# EasyEDA Pro project LC86G-PA Breakout Board V2_1 (easyEDA Pro project file).eprj

# Schematic Schematic1_1
Board Name: Board1_1; Create Date: 2025-05-26; Page Name: P1; Project Name: LC86G-PA Breakout Board V2; Schematic Name: Schematic1_1; Update Date: 2025-05-25; Company: EasyEDA.com; Page Size: A4; Version: V1.0
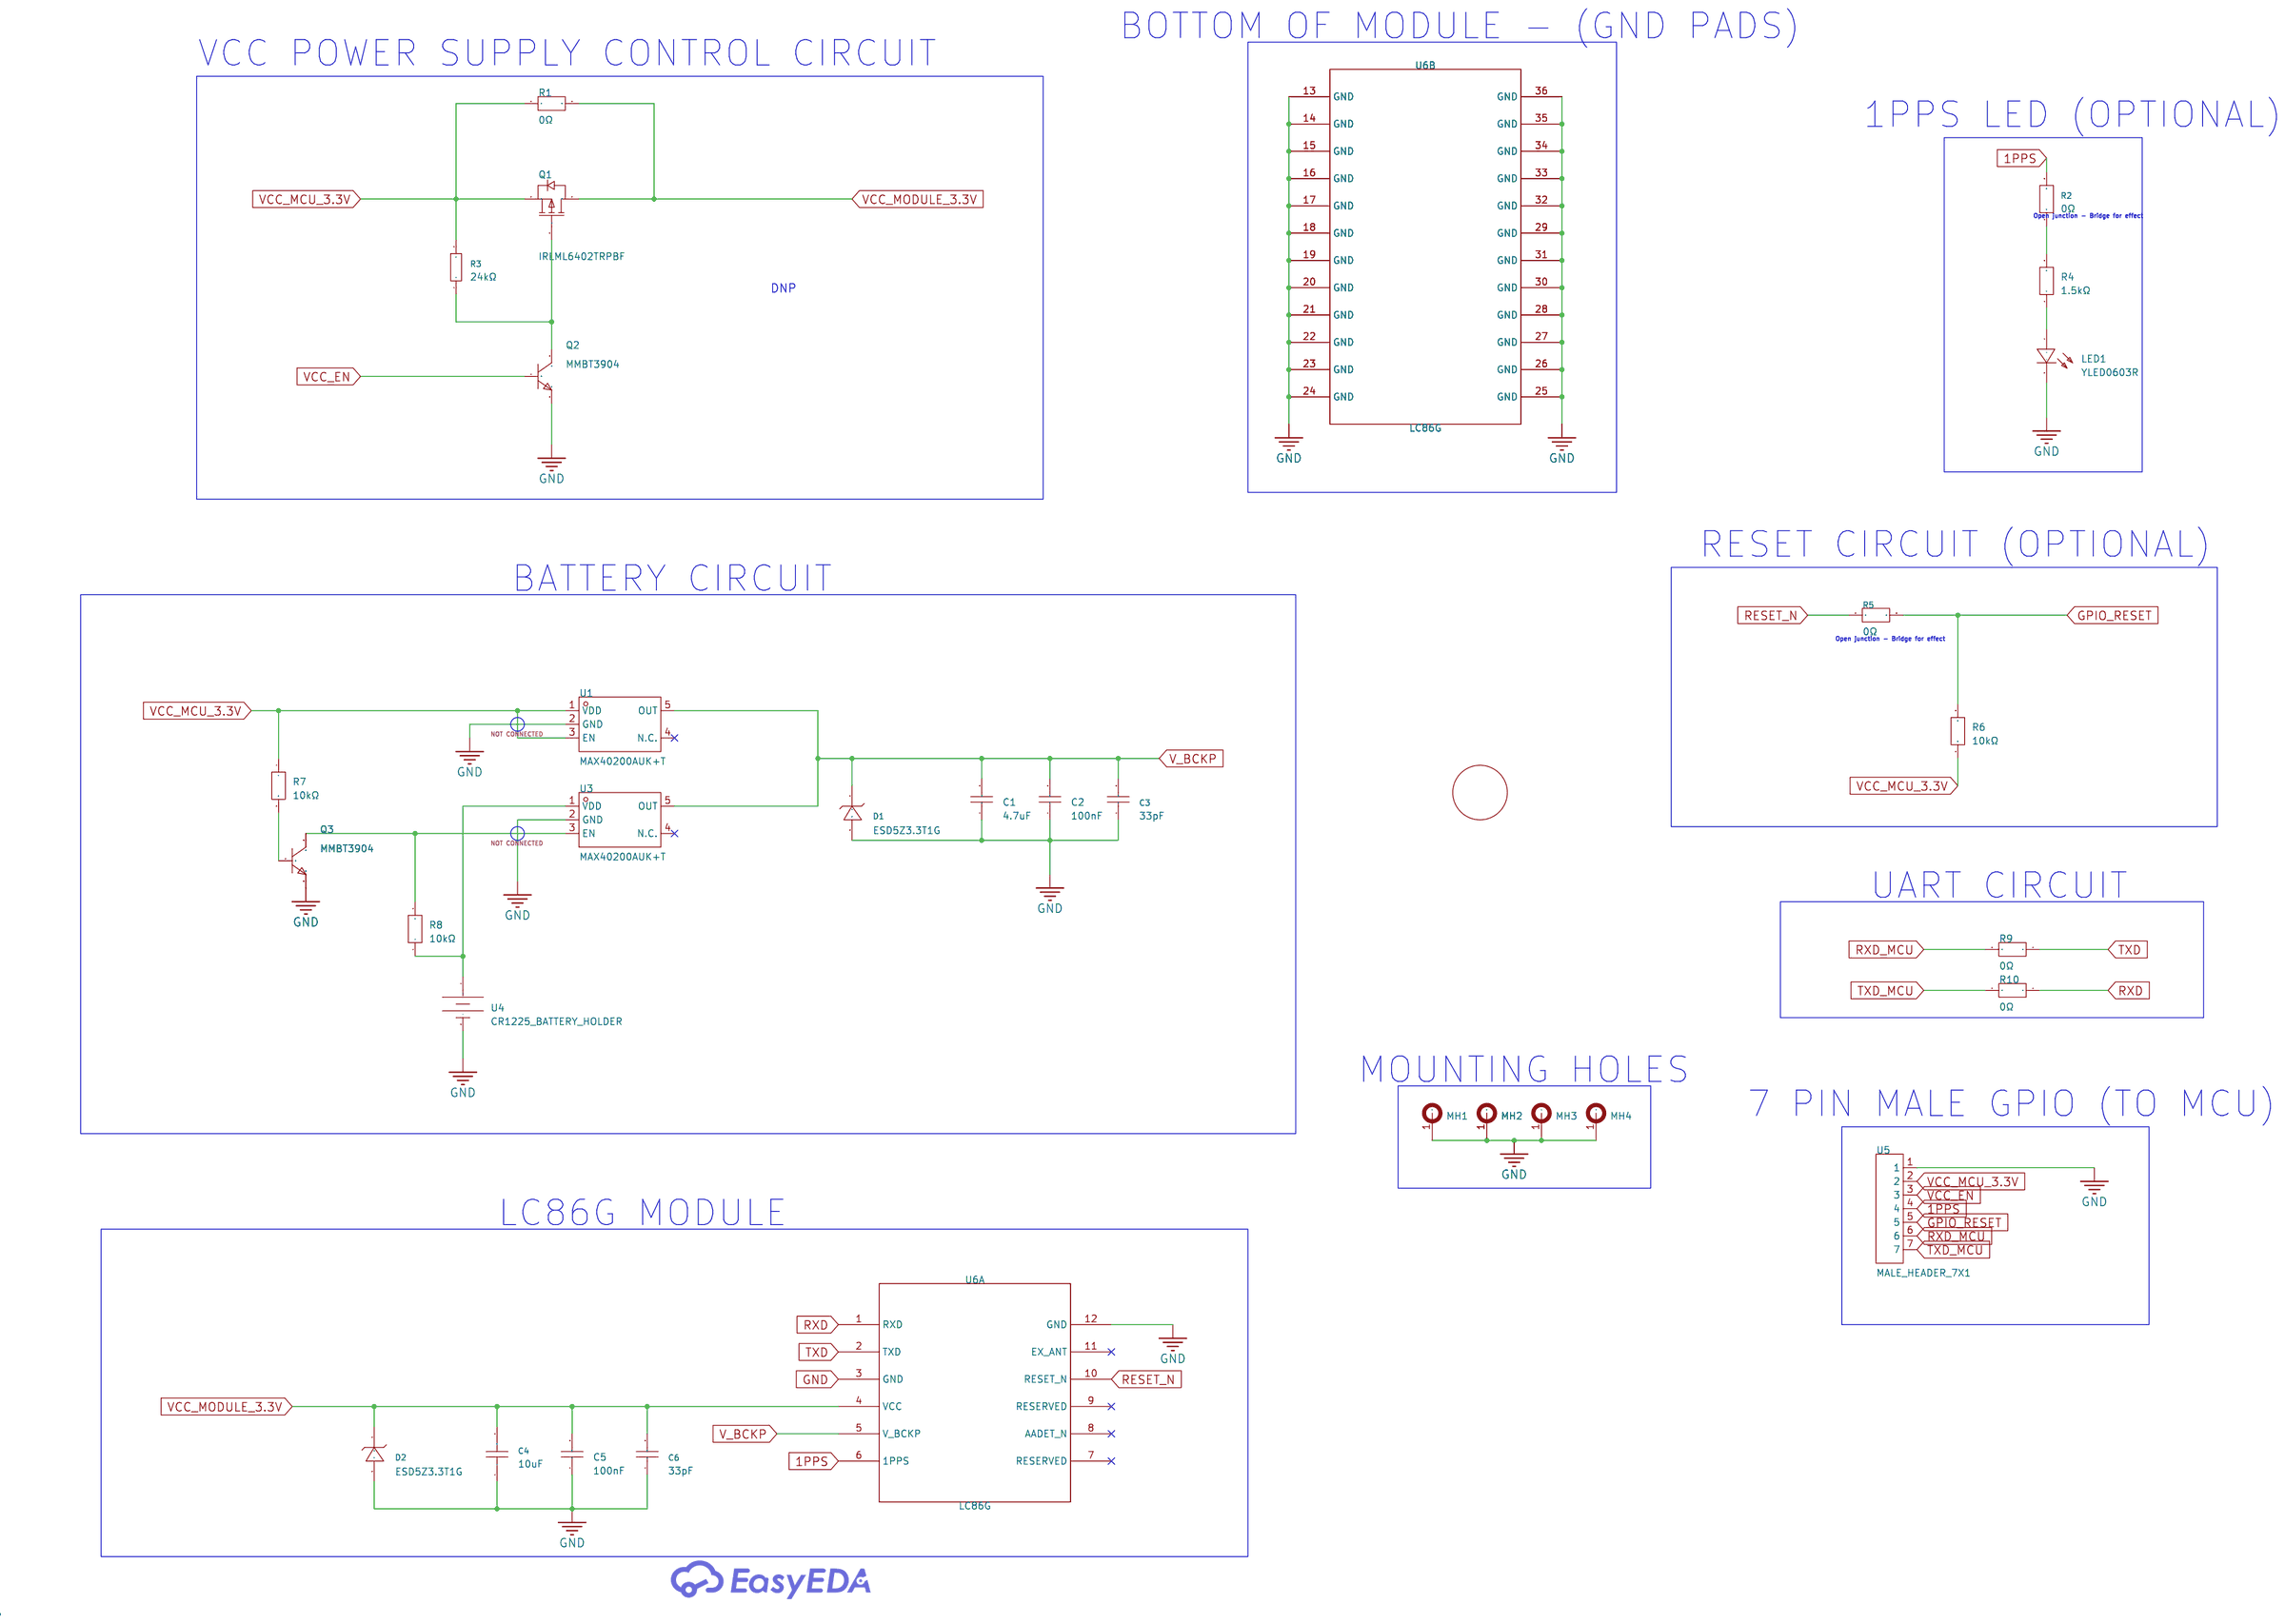
[diagram p0: schematic sheet]

## Parts
C1  4.7uF  [C0603]
C2  100nF  [C0603]
C3  33pF  [C0603]
C4  10uF  [C0603]
C5  100nF  [C0603]
C6  33pF  [C0603]
D1  ESD5Z3.3T1G  [SOD-523F_L1.2-W0.8-LS1.7-RD]
D2  ESD5Z3.3T1G  [SOD-523F_L1.2-W0.8-LS1.7-RD]
LED1  YLED0603R  [LED0603-FD]
MH1  -  [MH_7.5x2.7MM]  (no BOM)
MH2  -  [MH_7.5x2.7MM]  (no BOM)
MH3  -  [MH_7.5x2.7MM]  (no BOM)
MH4  -  [MH_7.5x2.7MM]  (no BOM)
Q1  IRLML6402TRPBF  [SOT-23-3_L2.9-W1.6-P1.90-LS2.8-BR]
Q2  MMBT3904  [SOT-23-3_L2.9-W1.4-P1.90-LS2.6-BR]
Q3  MMBT3904  [SOT-23-3_L2.9-W1.4-P1.90-LS2.6-BR]
R1  0Ω  [R0603]
R2  0Ω  [R0201]
R3  24kΩ  [R0603]
R4  1.5kΩ  [R0603]
R5  0Ω  [R0201]
R6  10kΩ  [R0603]
R7  10kΩ  [R0603]
R8  10kΩ  [R0603]
R9  0Ω  [R0603]
R10  0Ω  [R0603]
U1  MAX40200AUK+T  [TSOT-23-5_L2.9-W1.6-P0.95-LS2.8-BL]
U2  -  [KEEPOUT HOLEf]  (no BOM)
U3  MAX40200AUK+T  [TSOT-23-5_L2.9-W1.6-P0.95-LS2.8-BL]
U4  CR1225_BATTERY_HOLDER  [BAT-SMD_BS-12-B3AA011]
U5  MALE_HEADER_7X1  [HDR-TH_7P-P2.54-V-M]
U6  LC86G  [LC86G]  (sections 1,2)

## Library data of the parts
C1 = CL10A475KA8NQNC: Capacitance: Tolerance:±10% Tolerance:±10% Voltage Rated: Temperature Coefficient:; LCSC Part Name: 4.7uF ±10% 25V; Supplier Part: C69335; Manufacturer: SAMSUNG(三星); Supplier Footprint: 0603; JLCPCB Part Class: Extended Part; Datasheet: https://atta.szlcsc.com/upload/public/pdf/source/20161108/1478586410580.pdf; Supplier: LCSC; Tolerance: ±10%
C2 C5 = 0603B104K500NT_C30926: Capacitance:100nF Tolerance:±10% Tolerance:±10% Voltage Rating:50V Temperature Coefficient:X7R; LCSC Part Name: 100nF ±10% 50V; Supplier Part: C30926; Manufacturer: FH(风华); Manufacturer Part: 0603B104K500NT; Supplier Footprint: 0603; JLCPCB Part Class: Extended Part; Datasheet: https://atta.szlcsc.com/upload/public/pdf/source/20200305/C486355_26A10D38EF8C2A5C37091D0039909270.pdf; Supplier: LCSC; Tolerance: ±10%; Voltage Rating: 50V; Temperature Coefficient: X7R
C3 C6 = CC0603JRNPO9BN330: Capacitance: Tolerance:±5% Tolerance:±5% Voltage Rated: Temperature Coefficient:; LCSC Part Name: 33pF ±5% 50V; Supplier Part: C107047; Manufacturer: YAGEO(国巨); Supplier Footprint: 0603; JLCPCB Part Class: Extended Part; Datasheet: https://atta.szlcsc.com/upload/public/pdf/source/20170914/C128857_1505359892143968080.pdf; Supplier: LCSC; Tolerance: ±5%
C4 = GRM188R61E106KA73D: Capacitance: Tolerance:±10% Tolerance:±10% Voltage Rated: Temperature Coefficient:; LCSC Part Name: 10uF ±10% 25V; Supplier Part: C344022; Manufacturer: muRata(村田); Supplier Footprint: 0603; JLCPCB Part Class: Extended Part; Datasheet: https://atta.szlcsc.com/upload/public/pdf/source/20181211/C344022_BB98D43E7DA95E5A749FBFE073C8A3E0.pdf; Supplier: LCSC; Tolerance: ±10%
D1 D2 = ESD5Z3.3T1G_C61148: polarity:Unidirectional Reverse Stand-Off Voltage (Vrwm):3.3V Maximum Clamping Voltage:14.1V Peak Pulse Current (Ipp)@10/1000us:11.2A Breakdown Voltage:5V Type:ESD; Supplier Part: C61148; Manufacturer: onsemi(安森美); Supplier Footprint: SOD-523; JLCPCB Part Class: Extended Part; Datasheet: https://atta.szlcsc.com/upload/public/pdf/source/20151020/1457707483642.pdf; Supplier: LCSC; polarity: Unidirectional; Reverse Stand-Off Voltage (Vrwm): 3.3V; Maximum Clamping Voltage: 14.1V; Peak Pulse Current (Ipp)@10/1000us: 11.2A; Breakdown Voltage: 5V; Type: ESD
LED1 = YLED0603R: Supplier Part: C19171390; Manufacturer: YONGYUTAI(永裕泰); Supplier Footprint: 0603; JLCPCB Part Class: Extended Part; Datasheet: https://atta.szlcsc.com/upload/public/pdf/source/20231027/FB19AF06E2C70028E58AB5CEDD1BDC72.pdf; Supplier: LCSC; Emitted Color: Red; Forward Voltage (VF): 1.8V~2.4V; Forward Current: 25mA; Dominant Wavelength: 620nm~625nm; Operating Temperature: -40℃~+85℃
MH1-MH4 = MH_7.5x2.7MM
Q1 = IRLML6402TRPBF_C2593: Type:1 Piece P-Channel Drain Source Voltage (Vdss): Continuous Drain Current (Id): Drain Source On Resistance (RDS(on)@Vgs,Id):0.065Ω@4.5V,3.7A Power Dissipation (Pd): Gate Threshold Voltage (Vgs(th)@Id):0.55V@250uA Total Gate Charge (Qg@Vgs):12nC Input C; LCSC Part Name: 1个P沟道 耐压:20V 电流:3.7A; Supplier Part: C2593; Manufacturer: Infineon(英飞凌); Supplier Footprint: SOT-23; JLCPCB Part Class: Extended Part; Datasheet: https://atta.szlcsc.com/upload/public/pdf/source/20140818/1457707226203.pdf; Supplier: LCSC; Type: 1 Piece P-Channel; Drain Source On Resistance (RDS(on)@Vgs,Id): 0.065Ω@4.5V,3.7A; Gate Threshold Voltage (Vgs(th)@Id): 0.55V@250uA; Total Gate Charge (Qg@Vgs): 12nC; Input Capacitance (Ciss@Vds): 633pF; Reverse Transfer Capacitance (Crss@Vds): 110pF; Operating Temperature: -55℃~+150℃
Q2 Q3 = MMBT3904_C2848176: Supplier Part: C2848176; Manufacturer: IDCHIP(英锐芯); Supplier Footprint: SOT-23; JLCPCB Part Class: Extended Part; Datasheet: https://atta.szlcsc.com/upload/public/pdf/source/20210721/C2848176_BB7FA42B6B2CEFE392346A191FCA5A19.pdf; Supplier: LCSC
R1 R9 R10 = FRC0603F0000TS: Type:Thick Film Resistors Resistance:0Ω Tolerance:±1% Tolerance:±1% Power(Watts):100mW Voltage-Supply(Max):75V Operating Temperature:-55℃~+155℃ Operating Temperature:-55℃~+155℃; LCSC Part Name: 0Ω ±1% 100mW 厚膜电阻; Supplier Part: C2906974; Manufacturer: FOJAN(富捷); Supplier Footprint: 0603; JLCPCB Part Class: Extended Part; Datasheet: https://atta.szlcsc.com/upload/public/pdf/source/20211221/925EC7D7225764EE0046F22065062C87.pdf; Supplier: LCSC; Type: Thick Film Resistors; Tolerance: ±1%; Power(Watts): 100mW; Voltage-Supply(Max): 75V; Operating Temperature: -55℃~+155℃
R2 R5 = 0201WMF0000TEE: Type:Thick Film Resistors Resistance: Tolerance:±1% Tolerance:±1% Power(Watts): Overload Voltage (Max): Operating Temperature Range:-55℃~+155℃ Operating Temperature Range:-55℃~+155℃; LCSC Part Name: 0Ω ±1% 50mW 厚膜电阻; Supplier Part: C473473; Manufacturer: UNI-ROYAL(厚声); Supplier Footprint: 0201; JLCPCB Part Class: Extended Part; Datasheet: https://atta.szlcsc.com/upload/public/pdf/source/20200306/C422600_1E6D84923E4A46A82E41ADD87F860B5C.pdf; Supplier: LCSC; Type: Thick Film Resistors; Tolerance: ±1%; Operating Temperature Range: -55℃~+155℃
R3 = 0603WAF2402T5E: Type:Thick Film Resistors Resistance:24kΩ Tolerance:±1% Tolerance:±1% Power(Watts): Overload Voltage (Max): Temperature Coefficient:±100ppm/℃ Temperature Coefficient:±100ppm/℃ Operating Temperature Range:-55℃~+155℃ Operating Temperature Range:-55℃~+155℃; LCSC Part Name: 24kΩ ±1% 100mW 厚膜电阻; Supplier Part: C23352; Manufacturer: UNI-ROYAL(厚声); Supplier Footprint: 0603; JLCPCB Part Class: Basic Part; Datasheet: https://atta.szlcsc.com/upload/public/pdf/source/20200306/C422600_1E6D84923E4A46A82E41ADD87F860B5C.pdf; Supplier: LCSC; Type: Thick Film Resistors; Tolerance: ±1%; Temperature Coefficient: ±100ppm/℃; Operating Temperature Range: -55℃~+155℃
R4 = TD03G1501BT: LCSC Part Name: 薄膜电阻 1.5kΩ ±0.1% 100mW; Supplier Part: C666939; Manufacturer: FH(风华); Supplier Footprint: 0603; JLCPCB Part Class: Extended Part; Datasheet: https://atta.szlcsc.com/upload/public/pdf/source/20200616/C657321_2CFA27FA726BC0D0F6223AF922169515.pdf; Supplier: LCSC; Type: Thin Film Resistor; Tolerance: ±0.1%; Temperature Coefficient: ±25ppm/℃; Operating Temperature Range: -55℃~+155℃
R6-R8 = FRC0603J103 TS: Type:Thick Film Resistors Resistance:10kΩ Tolerance:±5% Tolerance:±5% Power(Watts):0.1W Voltage-Supply(Max):75V Temperature Coefficient:±100ppm/℃ Temperature Coefficient:±100ppm/℃ Operating Temperature:-55℃~+155℃ Operating Temperature:-55℃~+155℃; LCSC Part Name: 10kΩ ±5% 100mW 厚膜电阻; Supplier Part: C2930027; Manufacturer: FOJAN(富捷); Supplier Footprint: 0603; JLCPCB Part Class: Extended Part; Datasheet: https://atta.szlcsc.com/upload/public/pdf/source/20211221/925EC7D7225764EE0046F22065062C87.pdf; Supplier: LCSC; Type: Thick Film Resistors; Tolerance: ±5%; Power(Watts): 0.1W; Voltage-Supply(Max): 75V; Temperature Coefficient: ±100ppm/℃; Operating Temperature: -55℃~+155℃
U1 U3 = MAX40200AUK+T: Output Current:1.2A Input Voltage:1.5V~5.5V Input Voltage:1.5V~5.5V Operating Temperature-:-40℃~+125℃ Operating Temperature-:-40℃~+125℃; Supplier Part: C2649430; Manufacturer: ADI(亚德诺)/MAXIM(美信); Supplier Footprint: SOT-23-5; JLCPCB Part Class: Extended Part; Datasheet: https://atta.szlcsc.com/upload/public/pdf/source/20210603/11AAC644196C350B02B9F99D47093F30.pdf; Supplier: LCSC; Output Current: 1.2A; Input Voltage: 1.5V~5.5V; Operating Temperature	-: -40℃~+125℃
U2 = KEEPOUT HOLE
U4 = BS-12-B3AA013: Connector Type:Battery holder Battery Type:CR1225 Contact Material:Phosphor Bronze Contact Plating:Gold Operating Temperature Range:-55℃~+85℃ Operating Temperature Range:-55℃~+85℃; LCSC Part Name: 电池底座 适用电池:CR1225; Supplier Part: C5239863; Manufacturer: MYOUNG(美阳); Supplier Footprint: SMD; JLCPCB Part Class: Extended Part; Datasheet: https://atta.szlcsc.com/upload/public/pdf/source/20221102/4F90AF46A460056CAAD9F01033521D77.pdf; Supplier: LCSC; Connector Type: Battery holder; Battery Type: CR1225; Contact Material: Phosphor Bronze; Contact Plating: Gold; Operating Temperature Range: -55℃~+85℃
U5 = HB-PH3-25417PB2GOP: Pin Structure:1x7P Pitch:2.54mm Row Spacing:2.54mm Circluar Pins/Square Pins:Policy Mounting Type:Straight Number of Rows:Single Row Number of Pins:7P Current Rating:3A Voltage Rating (Max):250V Length of Mating Pin:6mm Insulation Height:2.54mm Length of; LCSC Part Name: 1x7P 间距:2.54mm 方针 直插; Supplier Part: C6332200; Manufacturer: HANBO(汉博); Supplier Footprint: 插件,P=2.54mm; JLCPCB Part Class: Extended Part; Datasheet: https://atta.szlcsc.com/upload/public/pdf/source/20230803/F72D259687963761DF1B552F3BB84A31.pdf; Supplier: LCSC; Pin Structure: 1x7P; Pitch: 2.54mm; Row Spacing: 2.54mm; Circluar Pins/Square Pins: Policy; Mounting Type: Straight; Number of Rows: Single Row; Number of Pins: 7P; Current Rating: 3A; Voltage Rating (Max): 250V; Length of Mating Pin: 6mm; Insulation Height: 2.54mm; Length of End Connection Pin: 3mm; Contact Material: Brass; Contact Plating: Gold; Operating Temperature: -40℃~+105℃; Color: Black
U6 = LC86G: LC86G Module 36PIN 16X16mm H6.98mm RO; Geometry_Height: 6.98mm; Manufacturer: Quectel; Part Description: LC86G Module 36PIN 16X16mm H6.98mm RO; Library Name: Quectel_xxx_SCH_Part_AD_Vx; Geometry.Height: 6.98mm

## Nets
GND: C1.1 C2.1 C3.1 C4.1 C5.1 C6.1 D1.2 D2.2 LED1.2(-) MH1.1 MH2.1 MH3.1 MH4.1 Q2.2(E) Q3.2(E) U1.2(GND) U3.2(GND) U4.2(-) U5.1 U6.3(GND) U6.12(GND) U6.13(GND) U6.14(GND) U6.15(GND) U6.16(GND) U6.17(GND) U6.18(GND) U6.19(GND) U6.20(GND) U6.21(GND) U6.22(GND) U6.23(GND) U6.24(GND) U6.25(GND) U6.26(GND) U6.27(GND) U6.28(GND) U6.29(GND) U6.30(GND) U6.31(GND) U6.32(GND) U6.33(GND) U6.34(GND) U6.35(GND) U6.36(GND)
VCC_EN: Q2.1(B) U5.3
VCC_MCU_3.3V: Q1.2(S) R1.2 R3.2 R6.1 R7.1 U1.1(VDD) U1.3(EN) U5.2
VCC_MODULE_3.3V: C4.2 C5.2 C6.2 D2.1 Q1.3(D) R1.1 U6.4(VCC)
1PPS: R2.2 U5.4 U6.6(1PPS)
GPIO_RESET: R5.2 R6.2 U5.5
RESET_N: R5.1 U6.10(RESET_N)
RXD: R10.1 U6.1(RXD)
RXD_MCU: R9.2 U5.6
TXD: R9.1 U6.2(TXD)
TXD_MCU: R10.2 U5.7
V_BCKP: C1.2 C2.2 C3.2 D1.1 U1.5(OUT) U3.5(OUT) U6.5(V_BCKP)
$1N2567: R8.1 U3.1(VDD) U4.1(+)
$1N4698: Q1.1(G) Q2.3(C) R3.1
$1N8070: Q3.1(B) R7.2
$1N8139: Q3.3(C) R8.2 U3.3(EN)
Net-(LED1-1): LED1.1(+) R4.1
Net-(R2-1): R2.1 R4.2

Not connected (* = marked no-connect by the designer): U1 4(N.C.)*; U3 4(N.C.)*; U6 7(RESERVED)* 8(AADET_N)* 9(RESERVED)* 11(EX_ANT)*

## Notes on the sheet
- BOTTOM OF MODULE - (GND PADS)
- VCC POWER SUPPLY CONTROL CIRCUIT
- 1PPS LED (OPTIONAL)
- Open junction - Bridge for effect
- DNP
- RESET CIRCUIT (OPTIONAL)
- BATTERY CIRCUIT
- Open junction - Bridge for effect
- NOT CONNECTED
- NOT CONNECTED
- UART CIRCUIT
- MOUNTING HOLES
- 7 PIN MALE GPIO (TO MCU)
- LC86G MODULE

# Board PCB4
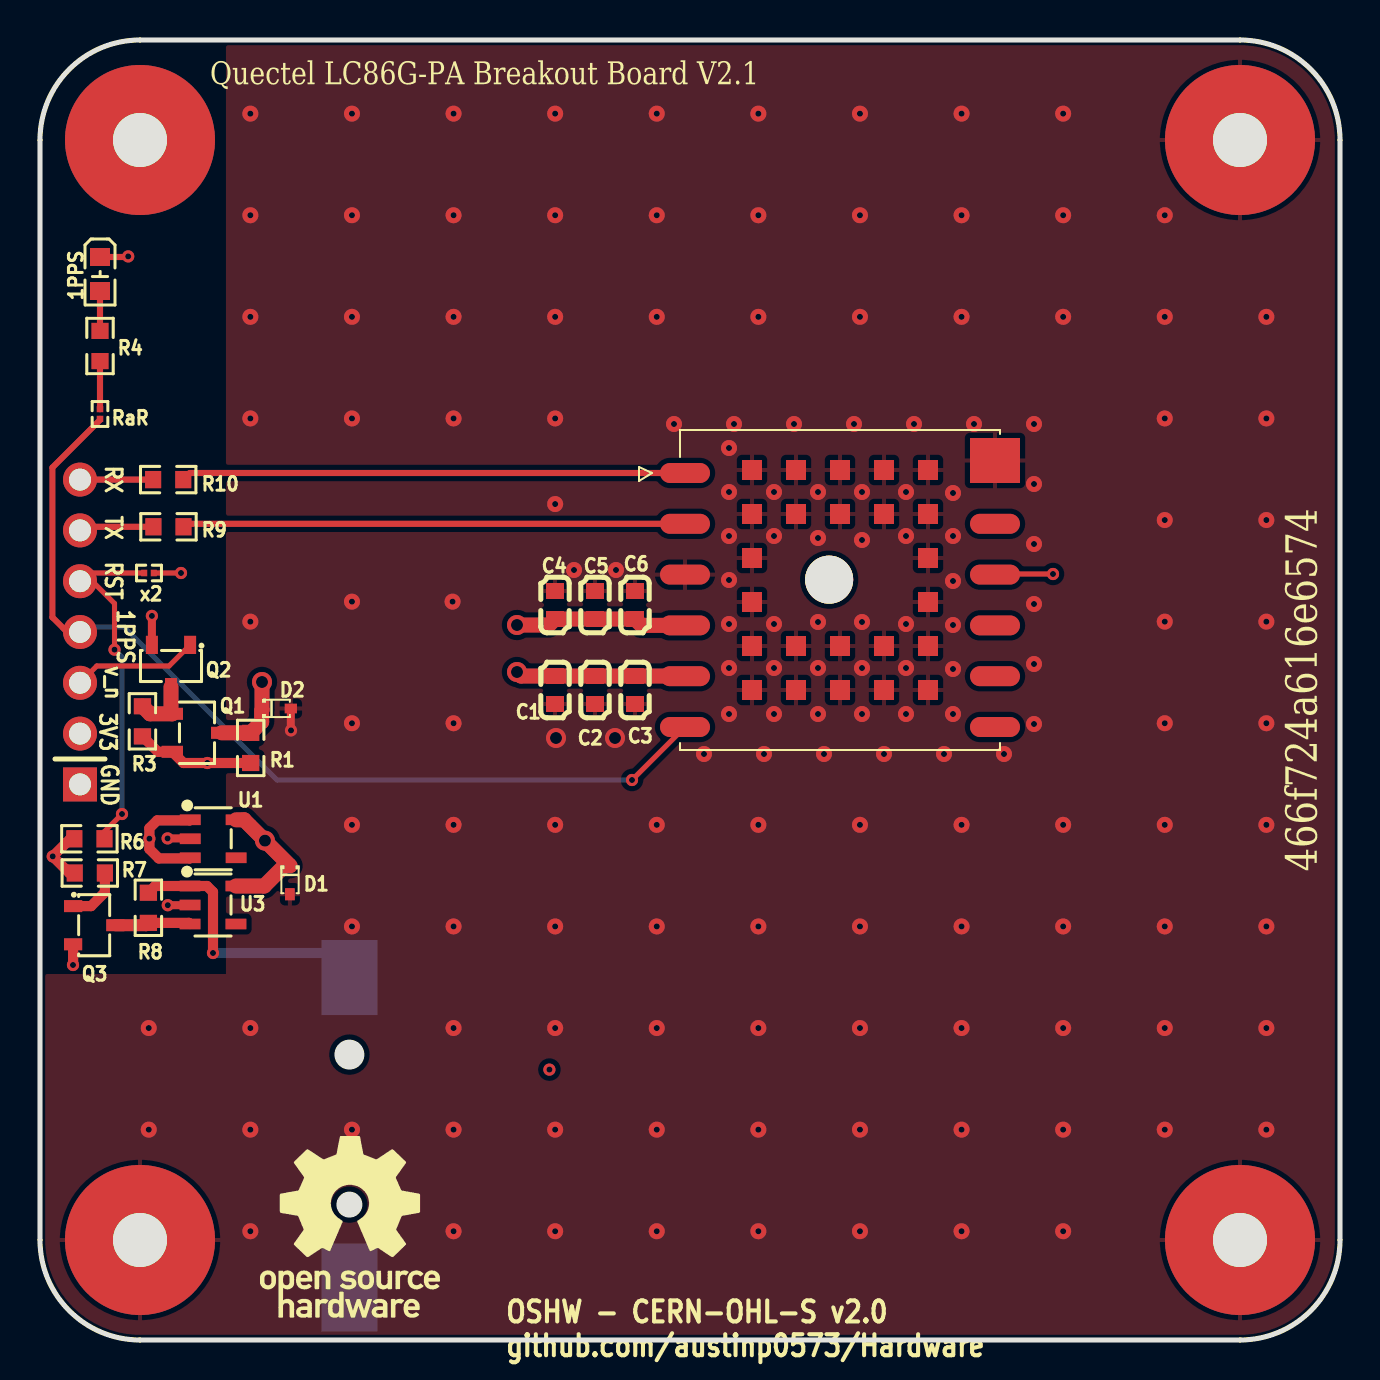
[diagram p1: board, top side]
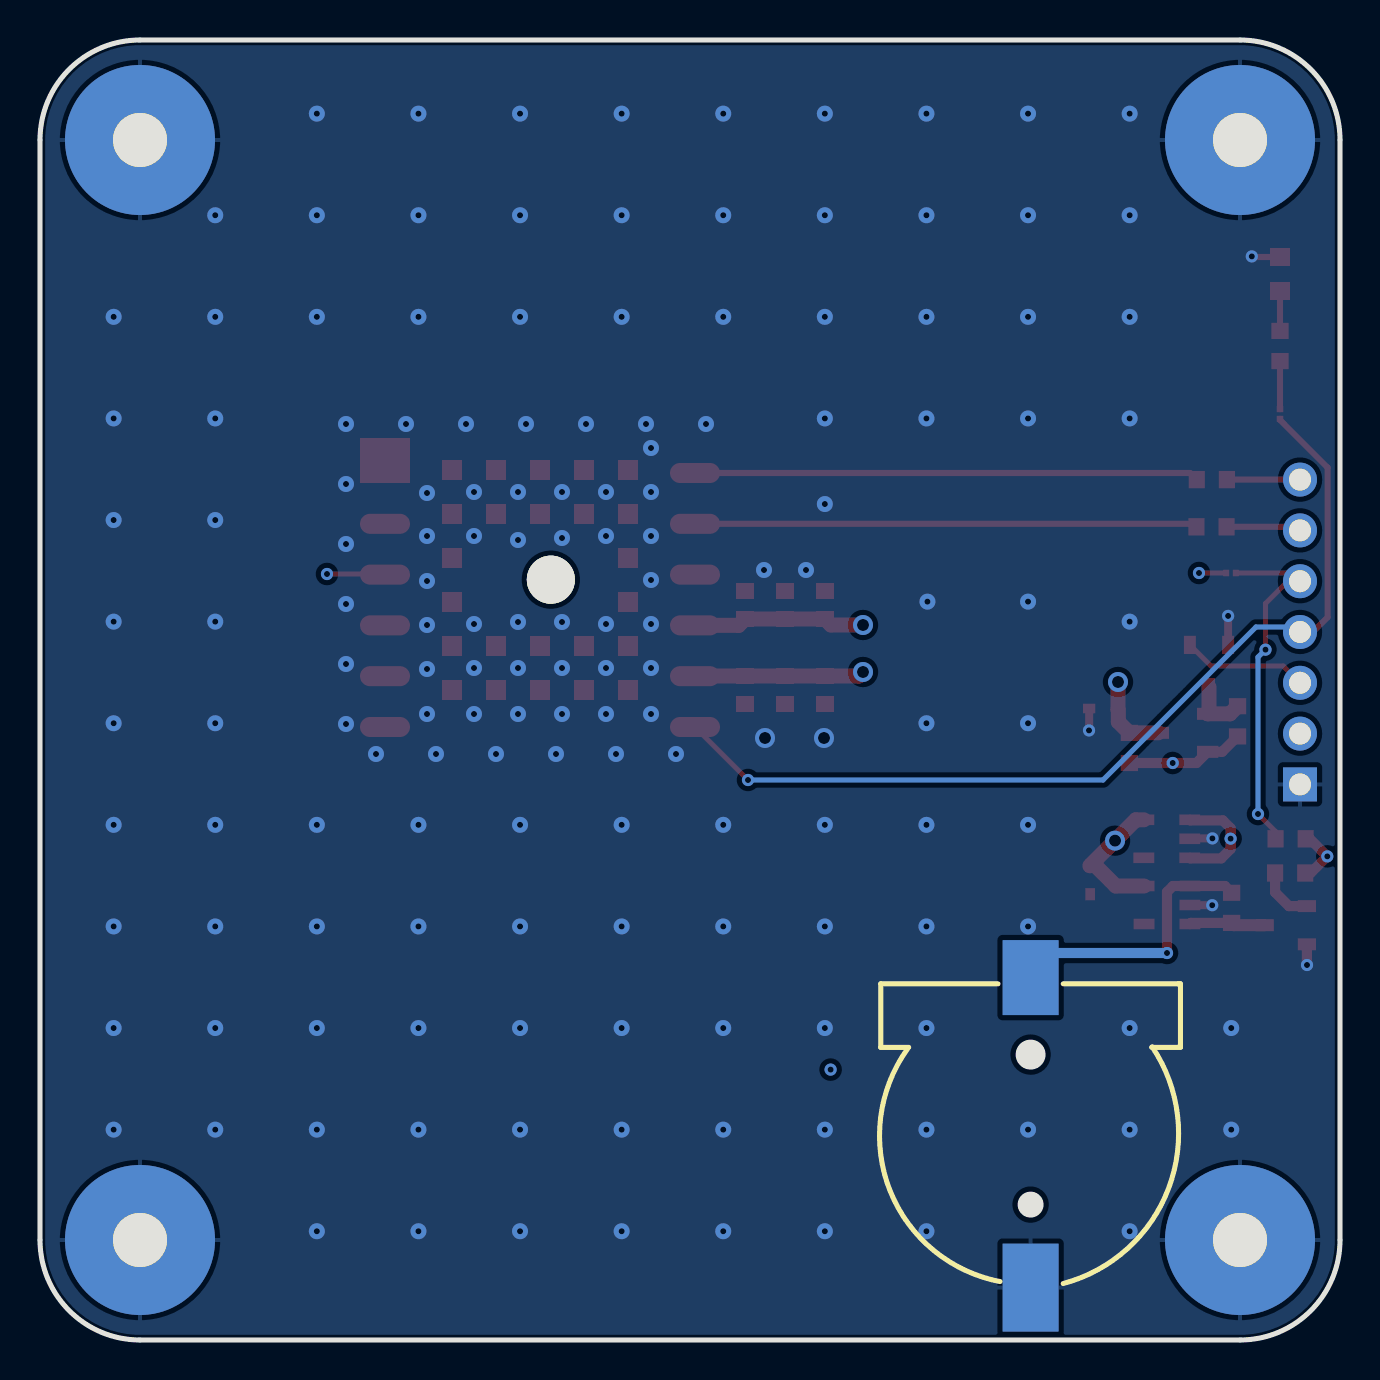
[diagram p2: board, bottom side, seen from below]

Outline 65 x 65 mm; copper layers: Top Layer, GND, VCC, Bottom Layer. Coordinates in mm from the lower left corner of the outline.
Outline path: 0,60 0,5 arc(1.46,1.46) 5,0 60,0 arc(63.54,1.46) 65,5 65,60 arc(63.54,63.54) 60,65 5,65 arc(1.46,63.54) 0,60
Stack: Top Layer 0.035mm Outer layer thickness 1oz / Dielectric1 0.2104mm 7628 RC49% 8.6mil / GND 0.0152mm Inner layer thickness / Dielectric2 1.065mm 1.1mm H/HOZ Copper / VCC 0.0152mm Inner layer thickness / Dielectric3 0.2104mm 7628 RC49% 8.6mil / Bottom Layer 0.035mm Outer layer thickness 1oz

## Design rules (mm)
template: Custom Config
spacing copperThickness1oz (default): track to track 0.102, other pairs 0.152 to 0.3
spacing copperThickness2oz: track to track 0.203, other pairs 0.152 to 0.3
spacing copperThicknessInner0.5oz: track to track 0.089, other pairs 0.152 to 0.3
track width copperThickness1oz (default): min 0.102, default 0.254, max 2.54
track width copperThickness2oz: min 0.203, default 0.254, max 2.54
track width copperThickness0.5oz: min 0.089, default 0.254, max 2.54
differential pair differentialPair (default): width min 0.127, default 0.254, max 2.54; gap min 0.152, default 0.152
via viaSize (default): diameter min 0.3, default 0.61, max 10; hole min 0.2, default 0.305, max 6.3
pour e264 uses copperRegion
pour e33 uses copperRegion
pour e590 uses copperRegion

## Placement (name value [footprint] x y rotation side)
1PPS  YLED0603R  [LED0603-FD]  3 53.3 90 top
C1  4.7uF  [C0603]  25.75 32.5 90 top
C2  100nF  [C0603]  27.75 32.5 90 top
C3  33pF  [C0603]  29.75 32.5 90 top
C4  10uF  [C0603]  25.75 36.75 270 top
C5  100nF  [C0603]  27.75 36.75 270 top
C6  33pF  [C0603]  29.75 36.75 270 top
D1  ESD5Z3.3T1G  [SOD-523F_L1.2-W0.8-LS1.7-RD]  12.5 23 270 top
D2  ESD5Z3.3T1G  [SOD-523F_L1.2-W0.8-LS1.7-RD]  11.83 31.58 0 top
MH1  -  [MH_7.5x2.7MM]  5 5 0 top
MH2  -  [MH_7.5x2.7MM]  5 60 0 top
MH3  -  [MH_7.5x2.7MM]  60 60 0 top
MH4  -  [MH_7.5x2.7MM]  60 5 0 top
Q1  IRLML6402TRPBF  [SOT-23-3_L2.9-W1.6-P1.90-LS2.8-BR]  7.85 30.36 180 top
Q2  MMBT3904  [SOT-23-3_L2.9-W1.4-P1.90-LS2.6-BR]  6.55 33.7 90 top
Q3  MMBT3904  [SOT-23-3_L2.9-W1.4-P1.90-LS2.6-BR]  2.71 20.74 180 top
R1  0Ω  [R0603]  10.53 29.6 270 top
R3  24kΩ  [R0603]  5.12 30.93 270 top
R4  1.5kΩ  [R0603]  3 49.7 270 top
R6  10kΩ  [R0603]  2.47 25.06 0 top
R7  10kΩ  [R0603]  2.49 23.35 0 top
R8  10kΩ  [R0603]  5.42 21.61 270 top
R9  0Ω  [R0603]  6.42 40.66 180 top
R10  0Ω  [R0603]  6.41 43.02 180 top
RaR  0Ω  [R0201]  3 46.3 270 top
U1  MAX40200AUK+T  [TSOT-23-5_L2.9-W1.6-P0.95-LS2.8-BL]  8.66 25.06 270 top
U2  -  [KEEPOUT HOLEf]  39.46 38.02 0 top
U3  MAX40200AUK+T  [TSOT-23-5_L2.9-W1.6-P0.95-LS2.8-BL]  8.65 21.75 270 top
U4  CR1225_BATTERY_HOLDER  [BAT-SMD_BS-12-B3AA011]  15.47 10.37 90 bottom
U5  MALE_HEADER_7X1  [HDR-TH_7P-P2.54-V-M]  2 35.4 90 top
U6  -  [LC86G]  40 37.5 0 top
x2  0Ω  [R0201]  5.45 38.35 180 top

## Footprints (pads in the part's own frame, mm; a bottom-side part is the same pattern mirrored in y, then rotated)
BAT-SMD_BS-12-B3AA011
  rect 3.75x2.8 smd: 1(7.75,0)
  rect 4.4x2.8 smd: 2(-7.75,0)
C0603
  rect 0.8x0.9 smd: 1(-0.7,0) 2(0.7,0)
HDR-TH_7P-P2.54-V-M
  rect 1.7x1.7 hole 1.1: 1(-7.62,0)
  round 1.7 hole 1.1: 2(-5.08,0) 3(-2.54,0) 4(0,0) 5(2.54,0) 6(5.08,0) 7(7.62,0)
KEEPOUT HOLEf
  round 2.4 hole 2.6x2.4: 1(0,0)
LC86G
  oval 2.5x1 smd: 1(-7.75,5.85) 2(-7.75,3.31) 3(-7.75,0.77) 4(-7.75,-1.77) 5(-7.75,-4.31) 6(-7.75,-6.85) 7(7.75,-6.85) 8(7.75,-4.31) 9(7.75,-1.77) 10(7.75,0.77) 11(7.75,3.31)
  rect 2.5x2.25 smd: 12(7.75,6.475)
  rect 1x1 smd: 13(-4.4,6) 14(-2.2,6) 15(0,6) 16(2.2,6) 17(4.4,6) 18(-4.4,3.8) 19(-2.2,3.8) 20(0,3.8) 21(2.2,3.8) 22(4.4,3.8) 23(-4.4,1.6) 24(4.4,1.6) 25(-4.4,-0.6) 26(4.4,-0.6) 27(-4.4,-2.8) 28(-2.2,-2.8) 29(0,-2.8) 30(2.2,-2.8) 31(4.4,-2.8) 32(-4.4,-5) 33(-2.2,-5) 34(0,-5) 35(2.2,-5) 36(4.4,-5)
LED0603-FD
  rect 0.9x1 smd: 1(-0.85,0) 2(0.85,0)
MH_7.5x2.7MM
  round 7.5 hole 2.7: 1(0,0)
R0201
  rect 0.303x0.324 smd: 1(-0.241,0) 2(0.241,0)
R0603
  rect 0.806x0.864 smd: 1(-0.753,0) 2(0.753,0)
SOD-523F_L1.2-W0.8-LS1.7-RD
  custom 0.609x0.483 smd: 1(-0.711,0.005) 2(0.711,-0.005)
SOT-23-3_L2.9-W1.4-P1.90-LS2.6-BR
  rect 0.91x0.6 smd: 1(1.055,-0.955) 2(1.055,0.955) 3(-1.055,0)
SOT-23-3_L2.9-W1.6-P1.90-LS2.8-BR
  rect 1.07x0.6 smd: 1(1.235,-0.95) 2(1.235,0.95) 3(-1.235,0)
TSOT-23-5_L2.9-W1.6-P0.95-LS2.8-BL
  rect 0.532x1.045 smd: 1(-0.95,-1.147) 2(0,-1.147) 3(0.95,-1.147) 4(0.95,1.147) 5(-0.95,1.147)

## Nets
GND: 1PPS.2 C1.1 C2.1 C3.1 C4.1 C5.1 C6.1 D1.2 D2.2 MH1.1 MH2.1 MH3.1 MH4.1 Q2.2 Q3.2 U1.2 U3.2 U4.2 U5.1 U6.3 U6.12 U6.13 U6.14 U6.15 U6.16 U6.17 U6.18 U6.19 U6.20 U6.21 U6.22 U6.23 U6.24 U6.25 U6.26 U6.27 U6.28 U6.29 U6.30 U6.31 U6.32 U6.33 U6.34 U6.35 U6.36
VCC_EN: Q2.1 U5.3
VCC_MCU_3.3V: Q1.2 R1.2 R3.2 R6.1 R7.1 U1.1 U1.3 U5.2
VCC_MODULE_3.3V: C4.2 C5.2 C6.2 D2.1 Q1.3 R1.1 U6.4
1PPS: RaR.2 U5.4 U6.6
GPIO_RESET: R6.2 U5.5 x2.2
RESET_N: U6.10 x2.1
RXD: R10.1 U6.1
RXD_MCU: R9.2 U5.6
TXD: R9.1 U6.2
TXD_MCU: R10.2 U5.7
V_BCKP: C1.2 C2.2 C3.2 D1.1 U1.5 U3.5 U6.5
$1N2567: R8.1 U3.1 U4.1
$1N4698: Q1.1 Q2.3 R3.1
$1N8070: Q3.1 R7.2
$1N8139: Q3.3 R8.2 U3.3
$1N11301: R4.2 RaR.1
$1N11305: 1PPS.1 R4.1

Pads without a net: U1 4; U2 1; U3 4; U6 7 8 9 11

## Via types
v1: diameter 0.61, hole 0.305, Top Layer to Bottom Layer, 16 vias
v2: diameter 1, hole 0.6, Top Layer to Bottom Layer, 6 vias
v3: diameter 0.8, hole 0.305, Top Layer to Bottom Layer, 152 vias

## Routing (per net, layer and track width the routed paths; a pad name or vN(x,y) marks a point on that pad's centre or on a via; arc(x,y) is an arc through that point)
GND: length 7.3
  Top Layer w0.305: v1(4.41,54.18) 4.38,54.15 1PPS.2
  Top Layer w0.399: 12.54,31.58 12.54,30.49 v1(12.55,30.48) ; U1.2 7.49,25.08 v1(6.38,25.08) ; v1(6.39,21.74) 7.49,21.74 U3.2 ; Q2.2 v1(5.59,36.2)
  Top Layer w0.508: 1.66,19.78 1.66,18.75 v1(1.65,18.75)
  vias: v2(25.8,30.1) v2(28.75,30.1) v3(5.44,15.6) v3(5.44,10.52) v3(10.52,61.32) v3(10.52,56.24) v3(10.52,51.16) v3(10.52,46.08) v3(10.52,35.92) v3(10.52,15.6) v3(10.52,10.52) v3(10.52,5.44) v3(15.6,61.32) v3(15.6,56.24) v3(15.6,51.16) v3(15.6,46.08) v3(15.6,36.92) v3(15.6,30.84) v3(15.6,25.76) v3(15.6,20.68) v3(15.6,10.52) v3(20.63,36.92) v3(20.68,61.32) v3(20.68,56.24) v3(20.68,51.16) v3(20.68,46.08) v3(20.68,30.84) v3(20.68,25.76) v3(20.68,20.68) v3(20.68,15.6) v3(20.68,10.52) v3(20.68,5.44) v3(25.76,61.32) v3(25.76,56.24) v3(25.76,51.16) v3(25.76,46.08) v3(25.76,41.8) v3(25.76,25.76) v3(25.76,20.68) v3(25.76,15.6) v3(25.76,10.52) v3(25.76,5.44) v3(26.7,38.5) v3(28.8,38.5) v3(30.84,61.32) v3(30.84,56.24) v3(30.84,51.16) v3(30.84,25.76) v3(30.84,20.68) v3(30.84,15.6) v3(30.84,10.52) v3(30.84,5.44) v3(31.7,45.8) v3(33.2,29.3) v3(34.45,44.6) v3(34.45,42.4) v3(34.45,40.2) v3(34.45,38) v3(34.45,35.8) v3(34.45,33.6) v3(34.45,31.3) v3(34.7,45.8) v3(35.92,61.32) v3(35.92,56.24) v3(35.92,51.16) v3(35.92,25.76) v3(35.92,20.68) v3(35.92,15.6) v3(35.92,10.52) v3(35.92,5.44) v3(36.2,29.3) v3(36.7,42.4) v3(36.7,40.2) v3(36.7,35.8) v3(36.7,33.6) v3(36.7,31.3) v3(37.7,45.8) v3(38.9,42.4) v3(38.9,40.1) v3(38.9,35.9) v3(38.9,33.6) v3(38.9,31.3) v3(39.2,29.3) v3(40.7,45.8) v3(41,61.32) v3(41,56.24) v3(41,51.16) v3(41,25.76) v3(41,20.68) v3(41,15.6) v3(41,10.52) v3(41,5.44) v3(41.1,42.4) v3(41.1,40) v3(41.1,35.9) v3(41.1,33.6) v3(41.1,31.3) v3(42.2,29.3) v3(43.3,42.4) v3(43.3,40.2) v3(43.3,35.8) v3(43.3,33.6) v3(43.3,31.3) v3(43.7,45.8) v3(45.2,29.3) v3(45.65,42.35) v3(45.65,40.2) v3(45.65,37.95) v3(45.65,35.75) v3(45.65,33.55) v3(45.65,31.3) v3(46.08,61.32) v3(46.08,56.24) v3(46.08,51.16) v3(46.08,25.76) v3(46.08,20.68) v3(46.08,15.6) v3(46.08,10.52) v3(46.08,5.44) v3(46.7,45.8) v3(48.2,29.3) v3(49.7,45.8) v3(49.7,42.8) v3(49.7,39.8) v3(49.7,36.8) v3(49.7,33.8) v3(49.7,30.8) v3(51.16,61.32) v3(51.16,56.24) v3(51.16,51.16) v3(51.16,25.76) v3(51.16,20.68) v3(51.16,15.6) v3(51.16,10.52) v3(51.16,5.44) v3(56.24,56.24) v3(56.24,51.16) v3(56.24,46.08) v3(56.24,41) v3(56.24,35.92) v3(56.24,30.84) v3(56.24,25.76) v3(56.24,20.68) v3(56.24,15.6) v3(56.24,10.52) v3(61.32,51.16) v3(61.32,46.08) v3(61.32,41) v3(61.32,35.92) v3(61.32,30.84) v3(61.32,25.76) v3(61.32,20.68) v3(61.32,15.6) v3(61.32,10.52)
VCC_EN: length 6.3
  Top Layer w0.254: U5.3 2.84,33.7 6.45,33.7 Q2.1
VCC_MCU_3.3V: length 14.4
  Top Layer w0.508: R7.1 1.47,23.35 v1(0.64,24.18) 1.51,25.06 R6.1 ; R3.2 5.89,29.41 Q1.2 7.17,28.85 v1(8.37,28.85) R1.2 ; U1.1 7.48,25.98 5.86,25.98 5.47,25.59 v1(5.47,25.07) 5.47,24.55 5.94,24.08 7.48,24.08 U1.3
VCC_MODULE_3.3V: length 12.8
  Top Layer w0.75: 11.08,31.43 11.08,30.91 R1.1 10.53,30.36 Q1.3 ; v2(23.85,35.75) 25.45,35.75 C4.2 C5.2 C6.2 30.07,35.73 U6.4 ; v2(11.1,32.9) 11.1,31.53 11.1,31.52
(no net):
  vias: v1(25.47,13.52)
1PPS: length 47
  Top Layer w0.254: U6.6 v1(29.6,28)
  Top Layer w0.3: RaR.2 3,46 0.62,43.62 0.62,36.13 1.35,35.4 1.8,35.4 1.8,35.4
  Bottom Layer w0.254: U5.4 2.25,35.65 4.2,35.65 11.85,28 v1(29.6,28)
GPIO_RESET: length 17.8
  Top Layer w0.254: v1(3.73,34.52) 3.73,36.82 2.61,37.94 U5.5 2.41,38.35 x2.2 ; R6.2 3.22,25.42 v1(4.1,26.3)
  Bottom Layer w0.254: v1(4.1,26.3) 4.1,34.14 v1(3.73,34.52)
RESET_N: length 60.7
  Top Layer w0.254: x2.1 v1(7.05,38.35) ; v1(50.65,38.3) 47.78,38.3 U6.10
  VCC w0.254: v1(7.05,38.35) 14.92,46.22 14.92,46.36 15.32,46.76 15.46,46.76 16.2,47.5 49.75,47.5 50.95,46.3 50.95,38.6 v1(50.65,38.3)
RXD: length 25.2
  Top Layer w0.305: R10.1 7.49,43.35 U6.1
RXD_MCU: length 3.7
  Top Layer w0.305: R9.2 2.18,40.66 U5.6
TXD: length 25.1
  Top Layer w0.305: U6.2 7.33,40.81 R9.1
TXD_MCU: length 3.7
  Top Layer w0.305: U5.7 R10.2
V_BCKP: length 15
  Top Layer w0.75: U3.5 11.21,22.7 12.27,23.76 ; U1.5 10.21,26.01 v2(11.25,24.97) D1.1 ; U6.5 32.24,33.2 C3.2 C2.2 C1.2 24.05,33.2 v2(23.85,33.4)
$1N2567: length 13.9
  Top Layer w0.508: R8.1 5.76,22.7 U3.1 8.35,22.7 8.65,22.4 v1(8.65,19.35)
  Bottom Layer w0.508: v1(8.65,19.35) 14.24,19.35 U4.1
$1N4698: length 3
  Top Layer w0.75: 5.12,31.69 5.5,31.31 Q1.1 6.55,31.38 Q2.3
$1N8070: length 2.8
  Top Layer w0.508: R7.2 3.24,22.38 2.56,21.69 1.66,21.69
$1N8139: length 3.8
  Top Layer w0.508: R8.2 7.45,20.86 U3.3
  Top Layer w0.6: Q3.3 5.3,20.74 R8.2
$1N11301: length 2.4
  Top Layer w0.305: RaR.1 R4.2
$1N11305: length 2
  Top Layer w0.305: R4.1 1PPS.1

## Copper pours and planes (outline as drawn; the poured copper is in the pictures)
GND on Top Layer: 9.3,65 9.3,18.3 0.3,18.3 0.2,18.2 0.2,0.1 64.7,0.1 64.9,0.3 64.9,64.9 9.4,64.9
GND on Bottom Layer: 0,60.1 0.01,60.44 0.06,60.88 0.15,61.32 0.28,61.75 0.45,62.17 0.65,62.57 0.89,62.95 1.16,63.3 1.46,63.64 1.8,63.94 2.15,64.21 2.53,64.45 2.93,64.65 3.35,64.82 3.78,64.95 4.22,65.04 4.66,65.09 5,65.1 60,65.1 60.34,65.09 60.78,65.04 61.22,64.95 61.65,64.82 62.07,64.65 62.47,64.45 62.85,64.21 63.2,63.94 63.54,63.64 63.84,63.3 64.11,62.95 64.35,62.57 64.55,62.17 64.72,61.75 64.85,61.32 64.94,60.88 64.99,60.44 65,60.1 65,5.1 64.99,4.76 64.94,4.32 64.85,3.88 64.72,3.45 64.55,3.03 64.35,2.63 64.11,2.25 63.84,1.9 63.54,1.56 63.2,1.26 62.85,0.99 62.47,0.75 62.07,0.55 61.65,0.38 61.22,0.25 60.78,0.16 60.34,0.11 60,0.1 5,0.1 4.66,0.11 4.22,0.16 3.78,0.25 3.35,0.38 2.93,0.55 2.53,0.75 2.15,0.99 1.8,1.26 1.46,1.56 1.16,1.9 0.89,2.25 0.65,2.63 0.45,3.03 0.28,3.45 0.15,3.88 0.06,4.32 0.01,4.76 0,5.1
GND on GND: 0,60 0.01,60.34 0.06,60.78 0.15,61.22 0.28,61.65 0.45,62.07 0.65,62.47 0.89,62.85 1.16,63.2 1.46,63.54 1.8,63.84 2.15,64.11 2.53,64.35 2.93,64.55 3.35,64.72 3.78,64.85 4.22,64.94 4.66,64.99 5,65 60,65 60.34,64.99 60.78,64.94 61.22,64.85 61.65,64.72 62.07,64.55 62.47,64.35 62.85,64.11 63.2,63.84 63.54,63.54 63.84,63.2 64.11,62.85 64.35,62.47 64.55,62.07 64.72,61.65 64.85,61.22 64.94,60.78 64.99,60.34 65,60 65,5 64.99,4.66 64.94,4.22 64.85,3.78 64.72,3.35 64.55,2.93 64.35,2.53 64.11,2.15 63.84,1.8 63.54,1.46 63.2,1.16 62.85,0.89 62.47,0.65 62.07,0.45 61.65,0.28 61.22,0.15 60.78,0.06 60.34,0.01 60,0 5,0 4.66,0.01 4.22,0.06 3.78,0.15 3.35,0.28 2.93,0.45 2.53,0.65 2.15,0.89 1.8,1.16 1.46,1.46 1.16,1.8 0.89,2.15 0.65,2.53 0.45,2.93 0.28,3.35 0.15,3.78 0.06,4.22 0.01,4.66 0,5
VCC_MCU_3.3V on VCC: 0.9,29.2 0.9,31.5 3.1,31.5 3.7,30.9 6.1,30.9 6.1,30.5 6.5,30.1 7,30.1 7.7,29.4 11,29.4 11.1,29.3 11.1,28.1 11,28 8.2,28 8,28.2 8,26.8 8.3,26.5 8.3,23.5 5.12,23.5 4.22,22.6 0.35,22.61 0.33,25.71 3.9,25.7 4,25.8 4,29.2
VCC_MODULE_3.3V on VCC: 8.45,30.05 8.45,31.5 10.5,31.5 10.5,36.3 10.4,36.4 30.03,36.4 30.13,36.3 30.13,35.12 30.15,35.1 11.5,35.1 11.45,35.05 11.45,30.15 11.35,30.05
V_BCKP on VCC: 9.3,25.25 9.3,26.8 14.8,26.8 22,34 22,34.05 33.33,34.05 33.35,33 22.6,32.9 13.7,23.85 13.55,23.85 12.8,24.6 11.15,24.6 10.55,25.2 10.55,25.25

## Text on the board
Top Silkscreen Layer: 3V3 | GND | RX | TX | RST | v_n | 1PPS | OSHW - CERN-OHL-S v2.0 / github.com/austinp0573/Hardware | Quectel LC86G-PA Breakout Board V2.1 | 466f724a616e6574
